# Altium schematic sheet LCL_12V_chp.SchDoc
size A3; Organization: Altium Limited; Address1: L3, 12a Rodborough Rd; Address2: Frenchs Forest; Address3: NSW; Address4: Australia 2086
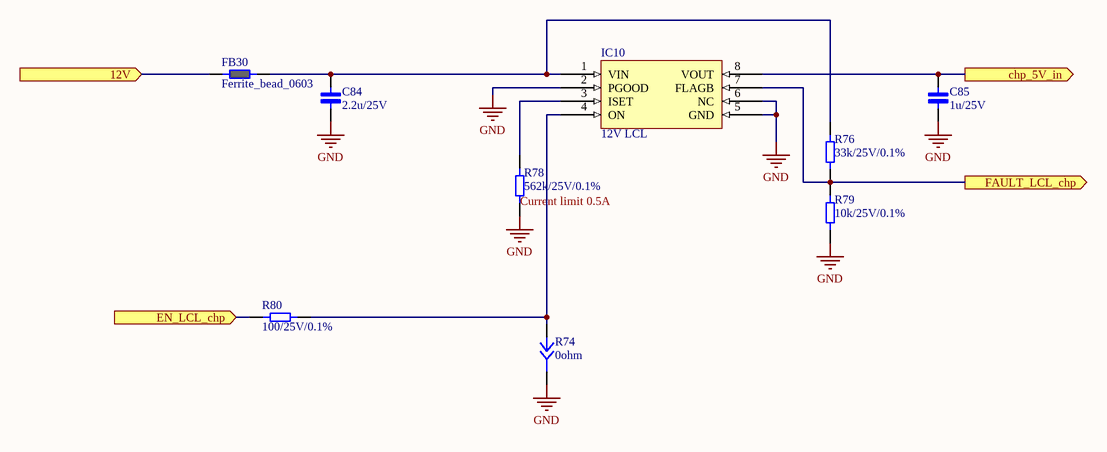
[diagram p0: LCL_12V_chp.SchDoc]

## Parts
C84  2.2u/25V  [CAP_0603]
C85  1u/25V  [CAP_0603]
FB30  Ferrite_bead_0603  [Ferrite_0603]
IC10  12V LCL  [SO8]
R74  0ohm  [Jumper 2]
R76  33k/25V/0.1%  [RES_0402]
R78  562k/25V/0.1%  [RES_0402]
R79  10k/25V/0.1%  [RES_0402]
R80  100/25V/0.1%  [RES_0402]

## Ports
12V (in), chp_5V_in (out), EN_LCL_chp (in), FAULT_LCL_chp (out)

## Nets
GND: C84.1 C85.1 IC10.2(PGOOD) IC10.5(GND) IC10.6(NC) R74.2 R78.1 R79.1
12V: FB30.1 ; port 12V
chp_5V_in: C85.2 IC10.8(VOUT) ; port chp_5V_in
EN_LCL_chp: R80.2 ; port EN_LCL_chp
FAULT_LCL_chp: IC10.7(FLAGB) R76.1 R79.2 ; port FAULT_LCL_chp
NetC84_2: C84.2 FB30.2 IC10.1(VIN) R76.2
NetIC10_3: IC10.3(ISET) R78.2
NetIC10_4: IC10.4(ON) R74.1 R80.1

## Notes on the sheet
- (near R78) Current limit 0.5A
- Title
- Size:
- Date:
- A3
- Number:
- Time:
- Revision:
- Sheet
- of
- File:

## Library data of the parts
C84 = Cap_0603_2.2u_25v: Ceramic Capacitor 2.2uF / 0603 / 25V / ±5%, Wurth Elektronik MLCC
C85 = Cap_0603_1u_25v: Ceramic Capacitor 1uF / 0603 / 25V / ±5%, Wurth Elektronik MLCC
FB30 = Ferrite_bead_0603: Ferrite bead
IC10 = FPF2700: FPF270xMX
R74 = Mini jumper
R76 = Res_0402_33k: Vishay, thin film resistor 33k/25V/0.1%
R78 = Res_0402_562k: Vishay, thin film resistor 562k/25V/0.1%
R79 = Res_0402_10k: Vishay, thin film resistor 10k/25V/0.1%
R80 = Res_0402_100: Vishay, thin film resistor 100/25V/0.1%